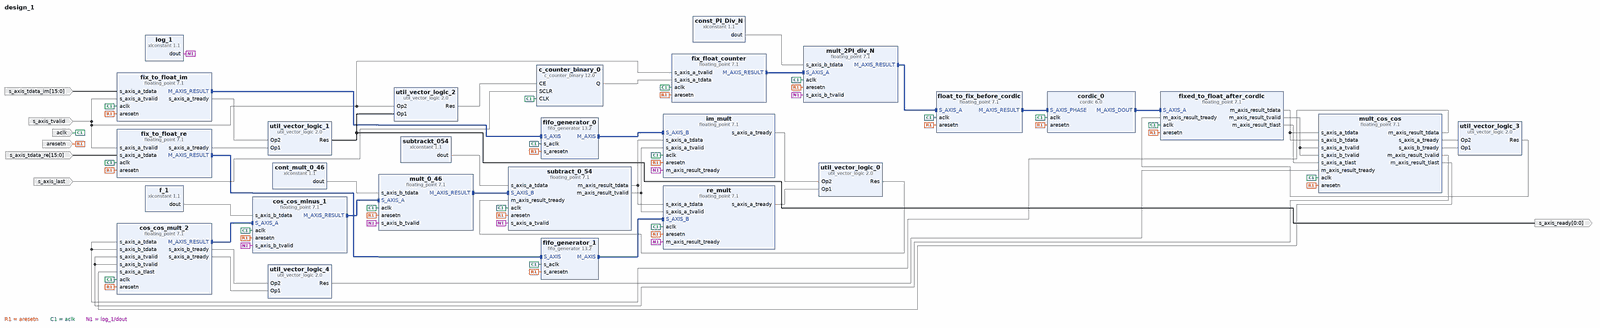
[diagram p0: block diagram of the top level, whole]
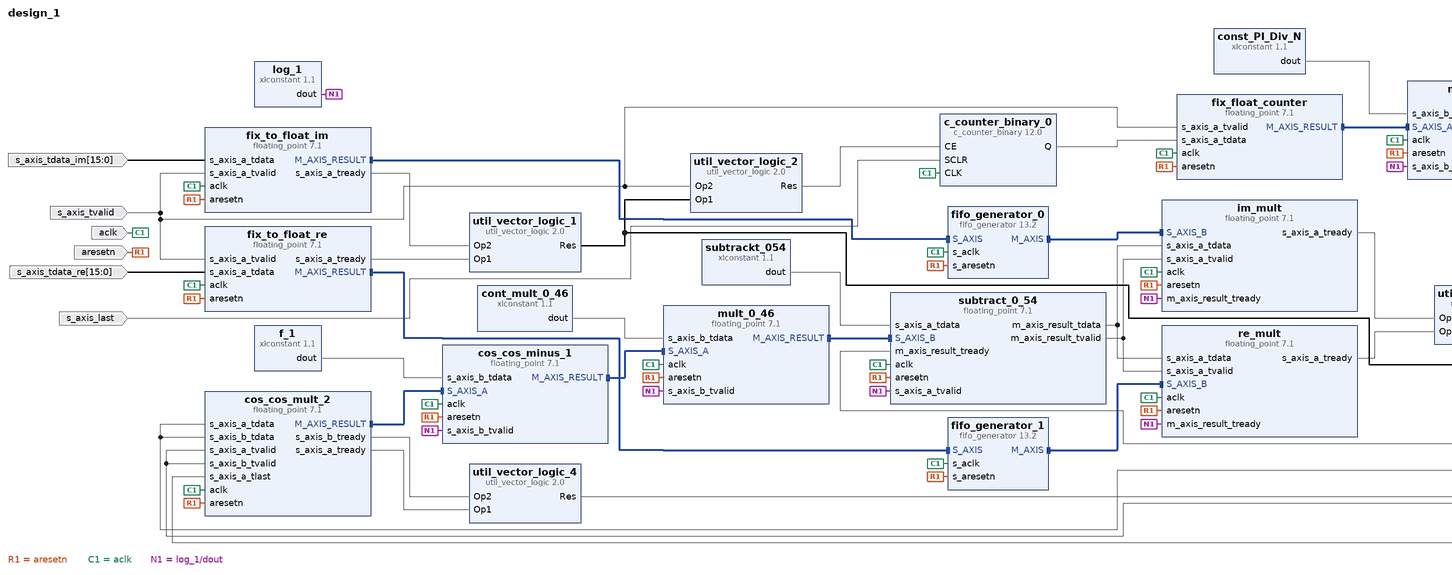
[diagram p1: block diagram of the top level, left part]
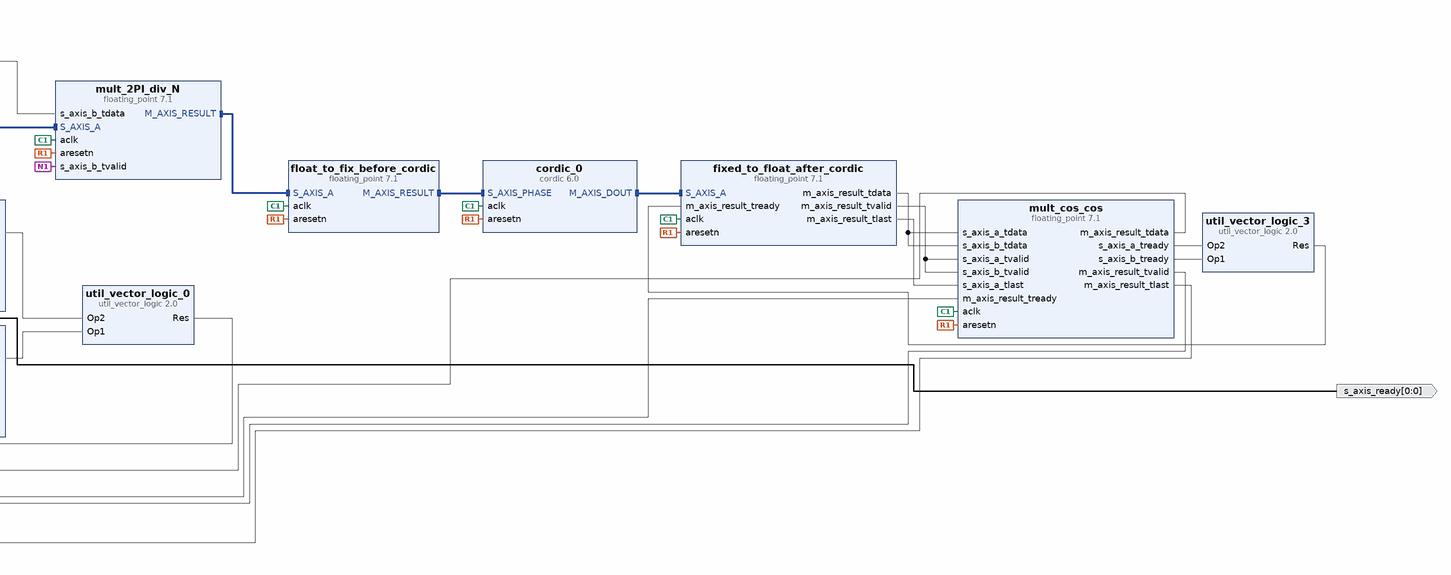
[diagram p2: block diagram of the top level, right part]
# Vivado block design design_1, xc7vx485tffg1761-2, Vivado 2019.1
create_bd_design design_1

create_bd_port -dir I -type rst aresetn
create_bd_port -dir I -type clk aclk
set_property -dict {CONFIG.ASSOCIATED_RESET aresetn:s_axis_last CONFIG.FREQ_HZ 10000000} [get_bd_ports aclk]
create_bd_port -dir I s_axis_tvalid
create_bd_port -dir I -type rst s_axis_last
set_property -dict {CONFIG.POLARITY ACTIVE_HIGH} [get_bd_ports s_axis_last]
create_bd_port -dir O -from 0 -to 0 s_axis_ready
create_bd_port -dir I -from 15 -to 0 s_axis_tdata_re
create_bd_port -dir I -from 15 -to 0 s_axis_tdata_im

create_bd_cell -type ip -vlnv xilinx.com:ip:floating_point:7.1 fix_to_float_re
set_property -dict [list \
  CONFIG.A_Precision_Type Custom \
  CONFIG.C_A_Exponent_Width 16 \
  CONFIG.C_A_Fraction_Width 0 \
  CONFIG.C_Accum_Input_Msb 32 \
  CONFIG.C_Accum_Lsb -31 \
  CONFIG.C_Accum_Msb 32 \
  CONFIG.C_Latency 7 \
  CONFIG.C_Mult_Usage No_Usage \
  CONFIG.C_Rate 1 \
  CONFIG.C_Result_Exponent_Width 8 \
  CONFIG.C_Result_Fraction_Width 24 \
  CONFIG.Has_ARESETn true \
  CONFIG.Has_A_TLAST false \
  CONFIG.Operation_Type Fixed_to_float \
  CONFIG.RESULT_TLAST_Behv Null \
  CONFIG.Result_Precision_Type Single \
] [get_bd_cells fix_to_float_re]
create_bd_cell -type ip -vlnv xilinx.com:ip:floating_point:7.1 fix_to_float_im
set_property -dict [list \
  CONFIG.A_Precision_Type Custom \
  CONFIG.C_A_Exponent_Width 16 \
  CONFIG.C_Accum_Input_Msb 32 \
  CONFIG.C_Accum_Lsb -31 \
  CONFIG.C_Accum_Msb 32 \
  CONFIG.C_Latency 7 \
  CONFIG.C_Mult_Usage No_Usage \
  CONFIG.C_Rate 1 \
  CONFIG.C_Result_Exponent_Width 8 \
  CONFIG.C_Result_Fraction_Width 24 \
  CONFIG.Has_ARESETn true \
  CONFIG.Operation_Type Fixed_to_float \
  CONFIG.Result_Precision_Type Single \
] [get_bd_cells fix_to_float_im]
create_bd_cell -type ip -vlnv xilinx.com:ip:c_counter_binary:12.0 c_counter_binary_0
set_property -dict {CONFIG.CE true CONFIG.Load false CONFIG.SCLR true} [get_bd_cells c_counter_binary_0]
create_bd_cell -type ip -vlnv xilinx.com:ip:floating_point:7.1 fix_float_counter
set_property -dict [list \
  CONFIG.A_Precision_Type Custom \
  CONFIG.C_A_Exponent_Width 16 \
  CONFIG.C_Accum_Input_Msb 32 \
  CONFIG.C_Accum_Lsb -31 \
  CONFIG.C_Accum_Msb 32 \
  CONFIG.C_Latency 7 \
  CONFIG.C_Mult_Usage No_Usage \
  CONFIG.C_Rate 1 \
  CONFIG.C_Result_Exponent_Width 8 \
  CONFIG.C_Result_Fraction_Width 24 \
  CONFIG.Has_ARESETn true \
  CONFIG.Operation_Type Fixed_to_float \
  CONFIG.Result_Precision_Type Single \
] [get_bd_cells fix_float_counter]
create_bd_cell -type ip -vlnv xilinx.com:ip:floating_point:7.1 mult_2PI_div_N
set_property -dict [list \
  CONFIG.C_Latency 9 \
  CONFIG.C_Mult_Usage Full_Usage \
  CONFIG.C_Rate 1 \
  CONFIG.C_Result_Exponent_Width 8 \
  CONFIG.C_Result_Fraction_Width 24 \
  CONFIG.Has_ARESETn true \
  CONFIG.Operation_Type Multiply \
  CONFIG.Result_Precision_Type Single \
] [get_bd_cells mult_2PI_div_N]
create_bd_cell -type ip -vlnv xilinx.com:ip:floating_point:7.1 subtract_0_54
set_property -dict {CONFIG.Add_Sub_Value Subtract CONFIG.Has_ARESETn true} [get_bd_cells subtract_0_54]
create_bd_cell -type ip -vlnv xilinx.com:ip:cordic:6.0 cordic_0
set_property -dict [list \
  CONFIG.ARESETN true \
  CONFIG.Data_Format SignedFraction \
  CONFIG.Functional_Selection Sin_and_Cos \
  CONFIG.Input_Width 32 \
  CONFIG.Output_Width 32 \
  CONFIG.flow_control Blocking \
  CONFIG.out_tlast_behv Pass_Phase_TLAST \
  CONFIG.out_tready true \
  CONFIG.phase_has_tlast true \
] [get_bd_cells cordic_0]
create_bd_cell -type ip -vlnv xilinx.com:ip:xlconstant:1.1 log_1
create_bd_cell -type ip -vlnv xilinx.com:ip:floating_point:7.1 float_to_fix_before_cordic
set_property -dict [list \
  CONFIG.C_Latency 7 \
  CONFIG.C_Mult_Usage No_Usage \
  CONFIG.C_Rate 1 \
  CONFIG.C_Result_Exponent_Width 3 \
  CONFIG.C_Result_Fraction_Width 29 \
  CONFIG.Has_ARESETn true \
  CONFIG.Has_A_TLAST true \
  CONFIG.Operation_Type Float_to_fixed \
  CONFIG.RESULT_TLAST_Behv Pass_A_TLAST \
  CONFIG.Result_Precision_Type Custom \
] [get_bd_cells float_to_fix_before_cordic]
create_bd_cell -type ip -vlnv xilinx.com:ip:floating_point:7.1 fixed_to_float_after_cordic
set_property -dict [list \
  CONFIG.A_Precision_Type Custom \
  CONFIG.C_A_Exponent_Width 2 \
  CONFIG.C_A_Fraction_Width 30 \
  CONFIG.C_Accum_Input_Msb 0 \
  CONFIG.C_Accum_Lsb -1 \
  CONFIG.C_Accum_Msb 32 \
  CONFIG.C_Latency 7 \
  CONFIG.C_Mult_Usage No_Usage \
  CONFIG.C_Rate 1 \
  CONFIG.C_Result_Exponent_Width 8 \
  CONFIG.C_Result_Fraction_Width 24 \
  CONFIG.Has_ARESETn true \
  CONFIG.Has_A_TLAST true \
  CONFIG.Operation_Type Fixed_to_float \
  CONFIG.RESULT_TLAST_Behv Pass_A_TLAST \
  CONFIG.Result_Precision_Type Single \
] [get_bd_cells fixed_to_float_after_cordic]
create_bd_cell -type ip -vlnv xilinx.com:ip:floating_point:7.1 re_mult
set_property -dict [list \
  CONFIG.C_Latency 9 \
  CONFIG.C_Mult_Usage Full_Usage \
  CONFIG.C_Rate 1 \
  CONFIG.C_Result_Exponent_Width 8 \
  CONFIG.C_Result_Fraction_Width 24 \
  CONFIG.Has_ARESETn true \
  CONFIG.Operation_Type Multiply \
  CONFIG.Result_Precision_Type Single \
] [get_bd_cells re_mult]
create_bd_cell -type ip -vlnv xilinx.com:ip:floating_point:7.1 im_mult
set_property -dict [list \
  CONFIG.C_Latency 9 \
  CONFIG.C_Mult_Usage Full_Usage \
  CONFIG.C_Rate 1 \
  CONFIG.C_Result_Exponent_Width 8 \
  CONFIG.C_Result_Fraction_Width 24 \
  CONFIG.Has_ARESETn true \
  CONFIG.Operation_Type Multiply \
  CONFIG.Result_Precision_Type Single \
] [get_bd_cells im_mult]
create_bd_cell -type ip -vlnv xilinx.com:ip:util_vector_logic:2.0 util_vector_logic_0
set_property -dict {CONFIG.C_SIZE 1} [get_bd_cells util_vector_logic_0]
create_bd_cell -type ip -vlnv xilinx.com:ip:xlconstant:1.1 subtrackt_054
set_property -dict {CONFIG.CONST_VAL 0x3f09d1f6 CONFIG.CONST_WIDTH 32} [get_bd_cells subtrackt_054]
create_bd_cell -type ip -vlnv xilinx.com:ip:floating_point:7.1 mult_0_46
set_property -dict [list \
  CONFIG.C_Latency 9 \
  CONFIG.C_Mult_Usage Full_Usage \
  CONFIG.C_Rate 1 \
  CONFIG.C_Result_Exponent_Width 8 \
  CONFIG.C_Result_Fraction_Width 24 \
  CONFIG.Has_ARESETn true \
  CONFIG.Operation_Type Multiply \
  CONFIG.Result_Precision_Type Single \
] [get_bd_cells mult_0_46]
create_bd_cell -type ip -vlnv xilinx.com:ip:util_vector_logic:2.0 util_vector_logic_1
set_property -dict {CONFIG.C_SIZE 1} [get_bd_cells util_vector_logic_1]
create_bd_cell -type ip -vlnv xilinx.com:ip:util_vector_logic:2.0 util_vector_logic_2
set_property -dict {CONFIG.C_SIZE 1} [get_bd_cells util_vector_logic_2]
create_bd_cell -type ip -vlnv xilinx.com:ip:xlconstant:1.1 cont_mult_0_46
set_property -dict {CONFIG.CONST_VAL 0x3eec5c14 CONFIG.CONST_WIDTH 32} [get_bd_cells cont_mult_0_46]
create_bd_cell -type ip -vlnv xilinx.com:ip:xlconstant:1.1 const_PI_Div_N
set_property -dict {CONFIG.CONST_VAL 0x3c49d9b4 CONFIG.CONST_WIDTH 32} [get_bd_cells const_PI_Div_N]
create_bd_cell -type ip -vlnv xilinx.com:ip:fifo_generator:13.2 fifo_generator_0
set_property -dict [list \
  CONFIG.Clock_Type_AXI Common_Clock \
  CONFIG.Enable_Data_Counts_axis false \
  CONFIG.Enable_Safety_Circuit true \
  CONFIG.Enable_TLAST true \
  CONFIG.FIFO_Implementation_axis Common_Clock_Block_RAM \
  CONFIG.FIFO_Implementation_rach Common_Clock_Distributed_RAM \
  CONFIG.FIFO_Implementation_rdch Common_Clock_Block_RAM \
  CONFIG.FIFO_Implementation_wach Common_Clock_Distributed_RAM \
  CONFIG.FIFO_Implementation_wdch Common_Clock_Block_RAM \
  CONFIG.FIFO_Implementation_wrch Common_Clock_Distributed_RAM \
  CONFIG.Full_Flags_Reset_Value 1 \
  CONFIG.INTERFACE_TYPE AXI_STREAM \
  CONFIG.Input_Depth_axis 256 \
  CONFIG.TDATA_NUM_BYTES 4 \
  CONFIG.TUSER_WIDTH 0 \
] [get_bd_cells fifo_generator_0]
create_bd_cell -type ip -vlnv xilinx.com:ip:fifo_generator:13.2 fifo_generator_1
set_property -dict [list \
  CONFIG.Enable_Safety_Circuit true \
  CONFIG.Enable_TLAST true \
  CONFIG.FIFO_Implementation_rach Common_Clock_Distributed_RAM \
  CONFIG.FIFO_Implementation_wach Common_Clock_Distributed_RAM \
  CONFIG.FIFO_Implementation_wrch Common_Clock_Distributed_RAM \
  CONFIG.Full_Flags_Reset_Value 1 \
  CONFIG.INTERFACE_TYPE AXI_STREAM \
  CONFIG.Input_Depth_axis 256 \
  CONFIG.TDATA_NUM_BYTES 4 \
  CONFIG.TUSER_WIDTH 0 \
] [get_bd_cells fifo_generator_1]
create_bd_cell -type ip -vlnv xilinx.com:ip:floating_point:7.1 mult_cos_cos
set_property -dict [list \
  CONFIG.C_Latency 9 \
  CONFIG.C_Mult_Usage Full_Usage \
  CONFIG.C_Rate 1 \
  CONFIG.C_Result_Exponent_Width 8 \
  CONFIG.C_Result_Fraction_Width 24 \
  CONFIG.Has_ARESETn true \
  CONFIG.Has_A_TLAST true \
  CONFIG.Operation_Type Multiply \
  CONFIG.RESULT_TLAST_Behv Pass_A_TLAST \
  CONFIG.Result_Precision_Type Single \
] [get_bd_cells mult_cos_cos]
create_bd_cell -type ip -vlnv xilinx.com:ip:util_vector_logic:2.0 util_vector_logic_3
set_property -dict {CONFIG.C_SIZE 1} [get_bd_cells util_vector_logic_3]
create_bd_cell -type ip -vlnv xilinx.com:ip:floating_point:7.1 cos_cos_mult_2
set_property -dict [list \
  CONFIG.Add_Sub_Value Add \
  CONFIG.C_Latency 12 \
  CONFIG.C_Mult_Usage Full_Usage \
  CONFIG.C_Rate 1 \
  CONFIG.C_Result_Exponent_Width 8 \
  CONFIG.C_Result_Fraction_Width 24 \
  CONFIG.Has_ARESETn true \
  CONFIG.Has_A_TLAST true \
  CONFIG.Operation_Type Add_Subtract \
  CONFIG.RESULT_TLAST_Behv Pass_A_TLAST \
  CONFIG.Result_Precision_Type Single \
] [get_bd_cells cos_cos_mult_2]
create_bd_cell -type ip -vlnv xilinx.com:ip:util_vector_logic:2.0 util_vector_logic_4
set_property -dict {CONFIG.C_SIZE 1} [get_bd_cells util_vector_logic_4]
create_bd_cell -type ip -vlnv xilinx.com:ip:floating_point:7.1 cos_cos_minus_1
set_property -dict [list \
  CONFIG.Add_Sub_Value Subtract \
  CONFIG.C_Latency 12 \
  CONFIG.C_Mult_Usage Full_Usage \
  CONFIG.Has_ARESETn true \
  CONFIG.Has_A_TLAST true \
  CONFIG.RESULT_TLAST_Behv Pass_A_TLAST \
] [get_bd_cells cos_cos_minus_1]
create_bd_cell -type ip -vlnv xilinx.com:ip:xlconstant:1.1 f_1
set_property -dict {CONFIG.CONST_VAL 0x3f800000 CONFIG.CONST_WIDTH 32} [get_bd_cells f_1]

# ---- connections ----

connect_bd_intf_net -intf_net floating_point_2_M_AXIS_RESULT1 [get_bd_intf_pins mult_0_46/M_AXIS_RESULT] [get_bd_intf_pins subtract_0_54/S_AXIS_B]
connect_bd_intf_net -intf_net floating_point_4_M_AXIS_RESULT [get_bd_intf_pins float_to_fix_before_cordic/S_AXIS_A] [get_bd_intf_pins mult_2PI_div_N/M_AXIS_RESULT]
connect_bd_intf_net [get_bd_intf_pins fix_to_float_im/M_AXIS_RESULT] [get_bd_intf_pins fifo_generator_0/S_AXIS]
connect_bd_intf_net [get_bd_intf_pins fifo_generator_1/M_AXIS] [get_bd_intf_pins re_mult/S_AXIS_B]
connect_bd_intf_net -intf_net floating_point_2_M_AXIS_RESULT [get_bd_intf_pins fix_float_counter/M_AXIS_RESULT] [get_bd_intf_pins mult_2PI_div_N/S_AXIS_A]
connect_bd_intf_net [get_bd_intf_pins cordic_0/M_AXIS_DOUT] [get_bd_intf_pins fixed_to_float_after_cordic/S_AXIS_A]
connect_bd_intf_net [get_bd_intf_pins fix_to_float_re/M_AXIS_RESULT] [get_bd_intf_pins fifo_generator_1/S_AXIS]
connect_bd_intf_net -intf_net floating_point_6_M_AXIS_RESULT [get_bd_intf_pins float_to_fix_before_cordic/M_AXIS_RESULT] [get_bd_intf_pins cordic_0/S_AXIS_PHASE]
connect_bd_intf_net [get_bd_intf_pins fifo_generator_0/M_AXIS] [get_bd_intf_pins im_mult/S_AXIS_B]
connect_bd_intf_net [get_bd_intf_pins mult_0_46/S_AXIS_A] [get_bd_intf_pins cos_cos_minus_1/M_AXIS_RESULT]
connect_bd_intf_net [get_bd_intf_pins cos_cos_minus_1/S_AXIS_A] [get_bd_intf_pins cos_cos_mult_2/M_AXIS_RESULT]
connect_bd_net [get_bd_ports aresetn] \
  [get_bd_pins fix_to_float_im/aresetn] [get_bd_pins fix_to_float_re/aresetn] [get_bd_pins fix_float_counter/aresetn] \
  [get_bd_pins float_to_fix_before_cordic/aresetn] [get_bd_pins mult_2PI_div_N/aresetn] [get_bd_pins cordic_0/aresetn] \
  [get_bd_pins fixed_to_float_after_cordic/aresetn] [get_bd_pins subtract_0_54/aresetn] [get_bd_pins re_mult/aresetn] \
  [get_bd_pins mult_0_46/aresetn] [get_bd_pins im_mult/aresetn] [get_bd_pins fifo_generator_1/s_aresetn] \
  [get_bd_pins fifo_generator_0/s_aresetn] [get_bd_pins mult_cos_cos/aresetn] [get_bd_pins cos_cos_mult_2/aresetn] \
  [get_bd_pins cos_cos_minus_1/aresetn]
connect_bd_net [get_bd_ports aclk] \
  [get_bd_pins fix_to_float_im/aclk] [get_bd_pins fix_to_float_re/aclk] [get_bd_pins c_counter_binary_0/CLK] \
  [get_bd_pins fix_float_counter/aclk] [get_bd_pins mult_2PI_div_N/aclk] [get_bd_pins float_to_fix_before_cordic/aclk] \
  [get_bd_pins cordic_0/aclk] [get_bd_pins fixed_to_float_after_cordic/aclk] [get_bd_pins re_mult/aclk] \
  [get_bd_pins subtract_0_54/aclk] [get_bd_pins mult_0_46/aclk] [get_bd_pins im_mult/aclk] \
  [get_bd_pins fifo_generator_1/s_aclk] [get_bd_pins fifo_generator_0/s_aclk] [get_bd_pins mult_cos_cos/aclk] \
  [get_bd_pins cos_cos_mult_2/aclk] [get_bd_pins cos_cos_minus_1/aclk]
connect_bd_net [get_bd_pins c_counter_binary_0/Q] [get_bd_pins fix_float_counter/s_axis_a_tdata]
connect_bd_net [get_bd_pins log_1/dout] \
  [get_bd_pins mult_2PI_div_N/s_axis_b_tvalid] [get_bd_pins subtract_0_54/s_axis_a_tvalid] \
  [get_bd_pins mult_0_46/s_axis_b_tvalid] [get_bd_pins im_mult/m_axis_result_tready] \
  [get_bd_pins re_mult/m_axis_result_tready] [get_bd_pins cos_cos_minus_1/s_axis_b_tvalid]
connect_bd_net -net floating_point_3_m_axis_result_tdata [get_bd_pins subtract_0_54/m_axis_result_tdata] \
  [get_bd_pins im_mult/s_axis_a_tdata] [get_bd_pins re_mult/s_axis_a_tdata]
connect_bd_net -net floating_point_3_m_axis_result_tvalid [get_bd_pins subtract_0_54/m_axis_result_tvalid] \
  [get_bd_pins im_mult/s_axis_a_tvalid] [get_bd_pins re_mult/s_axis_a_tvalid]
connect_bd_net -net floating_point_8_s_axis_a_tready [get_bd_pins im_mult/s_axis_a_tready] [get_bd_pins util_vector_logic_0/Op2]
connect_bd_net -net floating_point_5_s_axis_a_tready [get_bd_pins re_mult/s_axis_a_tready] [get_bd_pins util_vector_logic_0/Op1]
connect_bd_net [get_bd_pins util_vector_logic_0/Res] [get_bd_pins subtract_0_54/m_axis_result_tready]
connect_bd_net [get_bd_pins subtrackt_054/dout] [get_bd_pins subtract_0_54/s_axis_a_tdata]
connect_bd_net -net s_axis_a_tvalid_1 [get_bd_ports s_axis_tvalid] \
  [get_bd_pins fix_to_float_im/s_axis_a_tvalid] [get_bd_pins fix_to_float_re/s_axis_a_tvalid] \
  [get_bd_pins util_vector_logic_2/Op2] [get_bd_pins fix_float_counter/s_axis_a_tvalid]
connect_bd_net -net last_1 [get_bd_ports s_axis_last] [get_bd_pins c_counter_binary_0/SCLR]
connect_bd_net -net floating_point_0_s_axis_a_tready [get_bd_pins fix_to_float_re/s_axis_a_tready] [get_bd_pins util_vector_logic_1/Op1]
connect_bd_net -net floating_point_1_s_axis_a_tready [get_bd_pins fix_to_float_im/s_axis_a_tready] [get_bd_pins util_vector_logic_1/Op2]
connect_bd_net [get_bd_pins util_vector_logic_1/Res] [get_bd_ports s_axis_ready] [get_bd_pins util_vector_logic_2/Op1]
connect_bd_net [get_bd_ports s_axis_tdata_re] [get_bd_pins fix_to_float_re/s_axis_a_tdata]
connect_bd_net [get_bd_ports s_axis_tdata_im] [get_bd_pins fix_to_float_im/s_axis_a_tdata]
connect_bd_net [get_bd_pins util_vector_logic_2/Res] [get_bd_pins c_counter_binary_0/CE]
connect_bd_net [get_bd_pins cont_mult_0_46/dout] [get_bd_pins mult_0_46/s_axis_b_tdata]
connect_bd_net -net const_2PI_Div_N_dout [get_bd_pins const_PI_Div_N/dout] [get_bd_pins mult_2PI_div_N/s_axis_b_tdata]
connect_bd_net [get_bd_pins fixed_to_float_after_cordic/m_axis_result_tdata] \
  [get_bd_pins mult_cos_cos/s_axis_a_tdata] [get_bd_pins mult_cos_cos/s_axis_b_tdata]
connect_bd_net [get_bd_pins fixed_to_float_after_cordic/m_axis_result_tvalid] \
  [get_bd_pins mult_cos_cos/s_axis_b_tvalid] [get_bd_pins mult_cos_cos/s_axis_a_tvalid]
connect_bd_net -net floating_point_0_s_axis_a_tready1 [get_bd_pins mult_cos_cos/s_axis_a_tready] [get_bd_pins util_vector_logic_3/Op2]
connect_bd_net -net floating_point_0_s_axis_b_tready [get_bd_pins mult_cos_cos/s_axis_b_tready] [get_bd_pins util_vector_logic_3/Op1]
connect_bd_net [get_bd_pins util_vector_logic_3/Res] [get_bd_pins fixed_to_float_after_cordic/m_axis_result_tready]
connect_bd_net [get_bd_pins fixed_to_float_after_cordic/m_axis_result_tlast] [get_bd_pins mult_cos_cos/s_axis_a_tlast]
connect_bd_net [get_bd_pins mult_cos_cos/m_axis_result_tdata] [get_bd_pins cos_cos_mult_2/s_axis_a_tdata] [get_bd_pins cos_cos_mult_2/s_axis_b_tdata]
connect_bd_net [get_bd_pins mult_cos_cos/m_axis_result_tvalid] \
  [get_bd_pins cos_cos_mult_2/s_axis_b_tvalid] [get_bd_pins cos_cos_mult_2/s_axis_a_tvalid]
connect_bd_net [get_bd_pins mult_cos_cos/m_axis_result_tlast] [get_bd_pins cos_cos_mult_2/s_axis_a_tlast]
connect_bd_net [get_bd_pins util_vector_logic_4/Res] [get_bd_pins mult_cos_cos/m_axis_result_tready]
connect_bd_net [get_bd_pins cos_cos_mult_2/s_axis_b_tready] [get_bd_pins util_vector_logic_4/Op2]
connect_bd_net [get_bd_pins cos_cos_mult_2/s_axis_a_tready] [get_bd_pins util_vector_logic_4/Op1]
connect_bd_net [get_bd_pins f_1/dout] [get_bd_pins cos_cos_minus_1/s_axis_b_tdata]

validate_bd_design
save_bd_design
